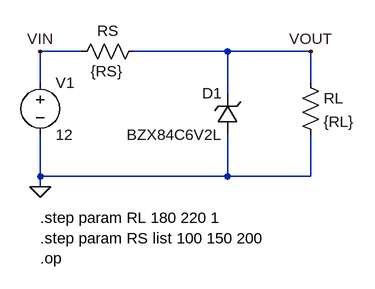
[diagram p0: schematic zener_regulator_loadreg.asc]
zener_regulator_loadreg.asc, the LTspice schematic file:
Version 4
SHEET 1 880 680
WIRE 0 64 -64 64
WIRE 224 64 80 64
WIRE 352 64 224 64
WIRE -64 112 -64 64
WIRE 352 112 352 64
WIRE 224 128 224 64
WIRE -64 256 -64 192
WIRE 224 256 224 192
WIRE 224 256 -64 256
WIRE 352 256 352 192
WIRE 352 256 224 256
WIRE -64 272 -64 256
FLAG -64 272 0
FLAG 352 64 VOUT
FLAG -64 64 VIN
SYMBOL res 336 96 R0
SYMATTR InstName RL
SYMATTR Value {RL}
SYMBOL res 96 48 R90
WINDOW 0 0 56 VBottom 2
WINDOW 3 62 58 VBottom 2
SYMATTR InstName RS
SYMATTR Value {RS}
SYMBOL voltage -64 96 R0
WINDOW 123 0 0 Left 0
WINDOW 39 0 0 Left 0
SYMATTR InstName V1
SYMATTR Value 12
SYMBOL zener 240 192 R180
WINDOW 0 24 64 Left 2
WINDOW 3 24 0 Left 2
SYMATTR InstName D1
SYMATTR Value BZX84C6V2L
TEXT -64 320 Left 2 !.step param RL 180 220 1\n.step param RS list 100 150 200\n.op

The netlist it stands for:
* zener_regulator_loadreg.asc
RL VOUT 0 {RL}
RS VOUT VIN {RS}
V1 VIN 0 12
D1 0 VOUT BZX84C6V2L
.model D D
.lib standard.dio
.step param RL 180 220 1
.step param RS list 100 150 200
.op
.backanno
.end